# EAGLE schematic FINAL schematic (EAGLE 6.5.0)
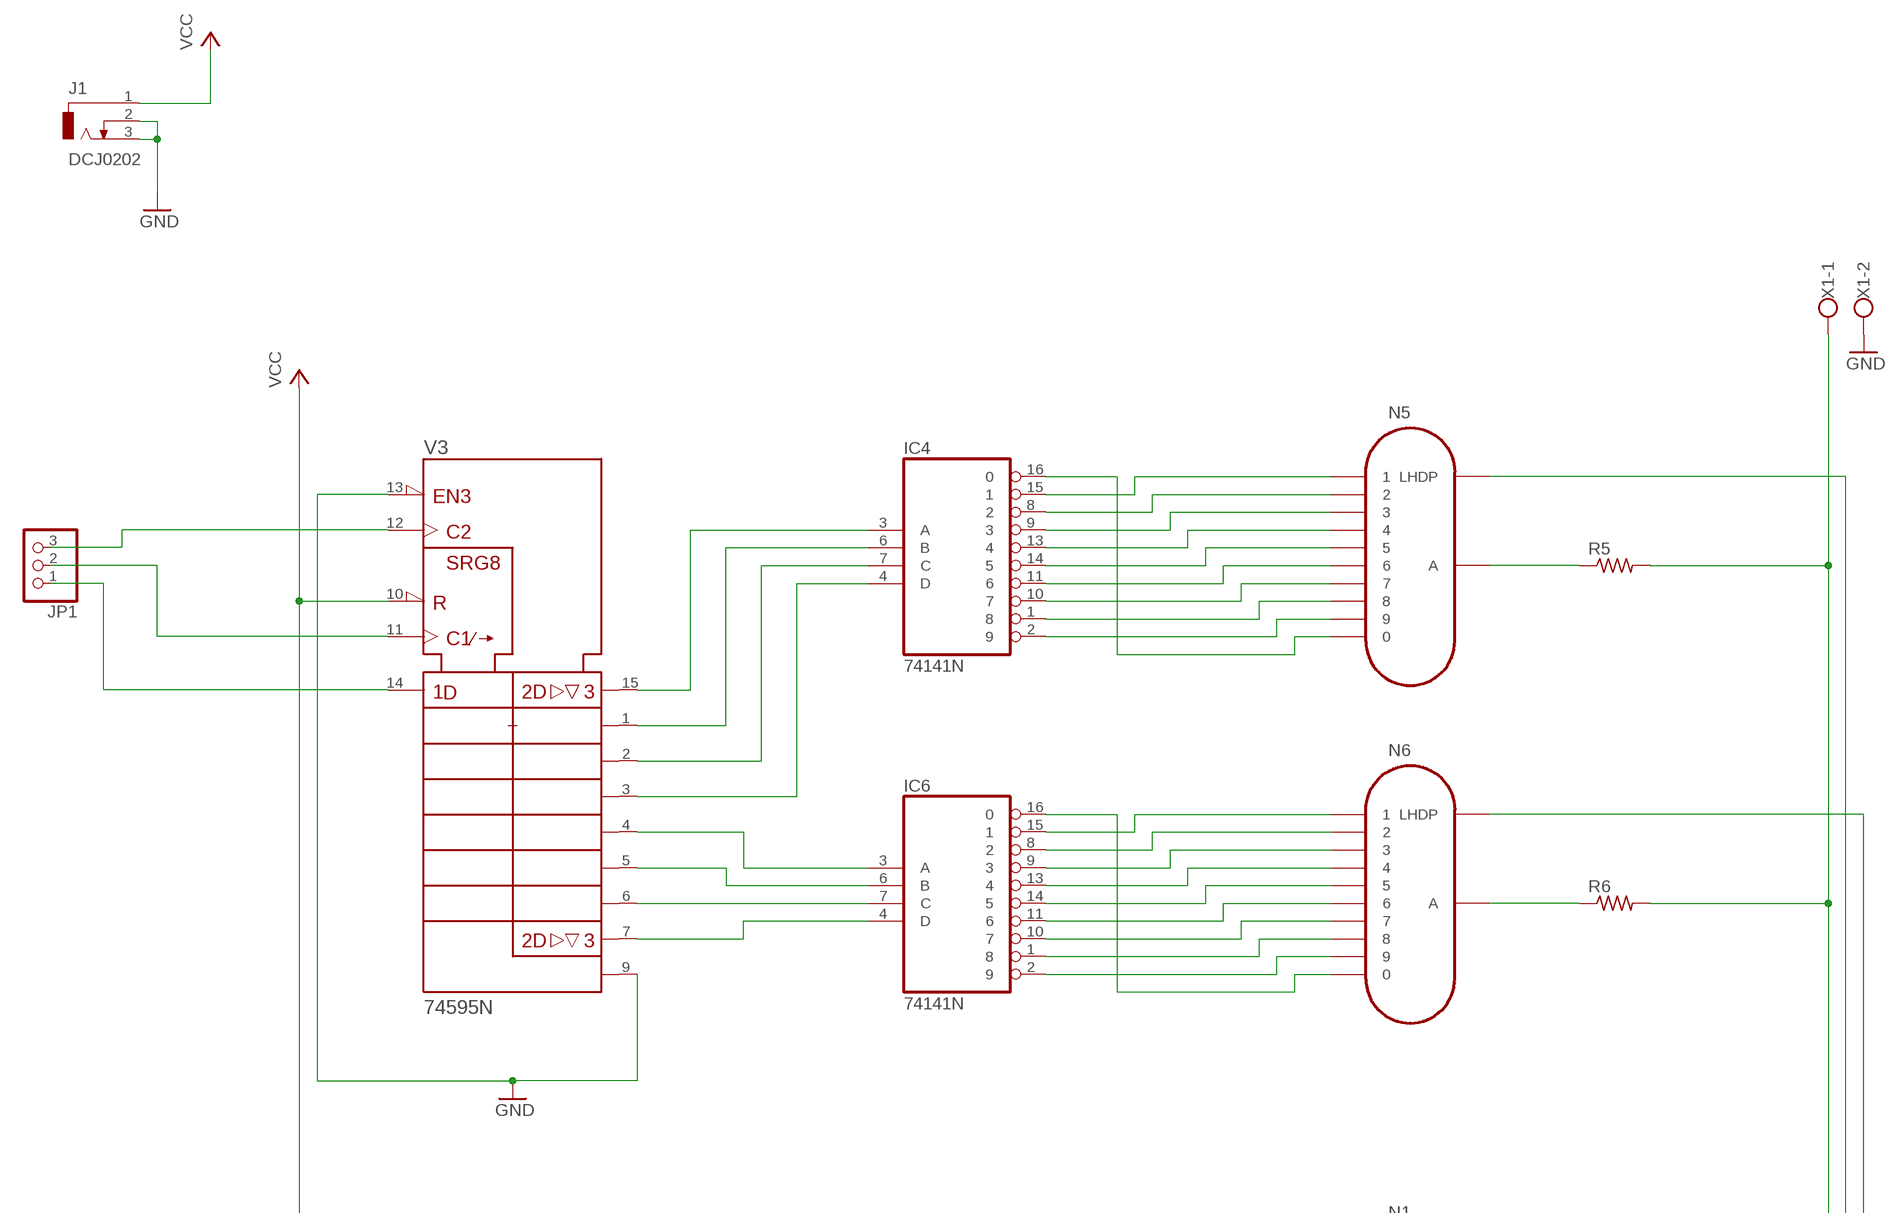
[diagram p0: schematic, sheet 1, part 1 of 2]
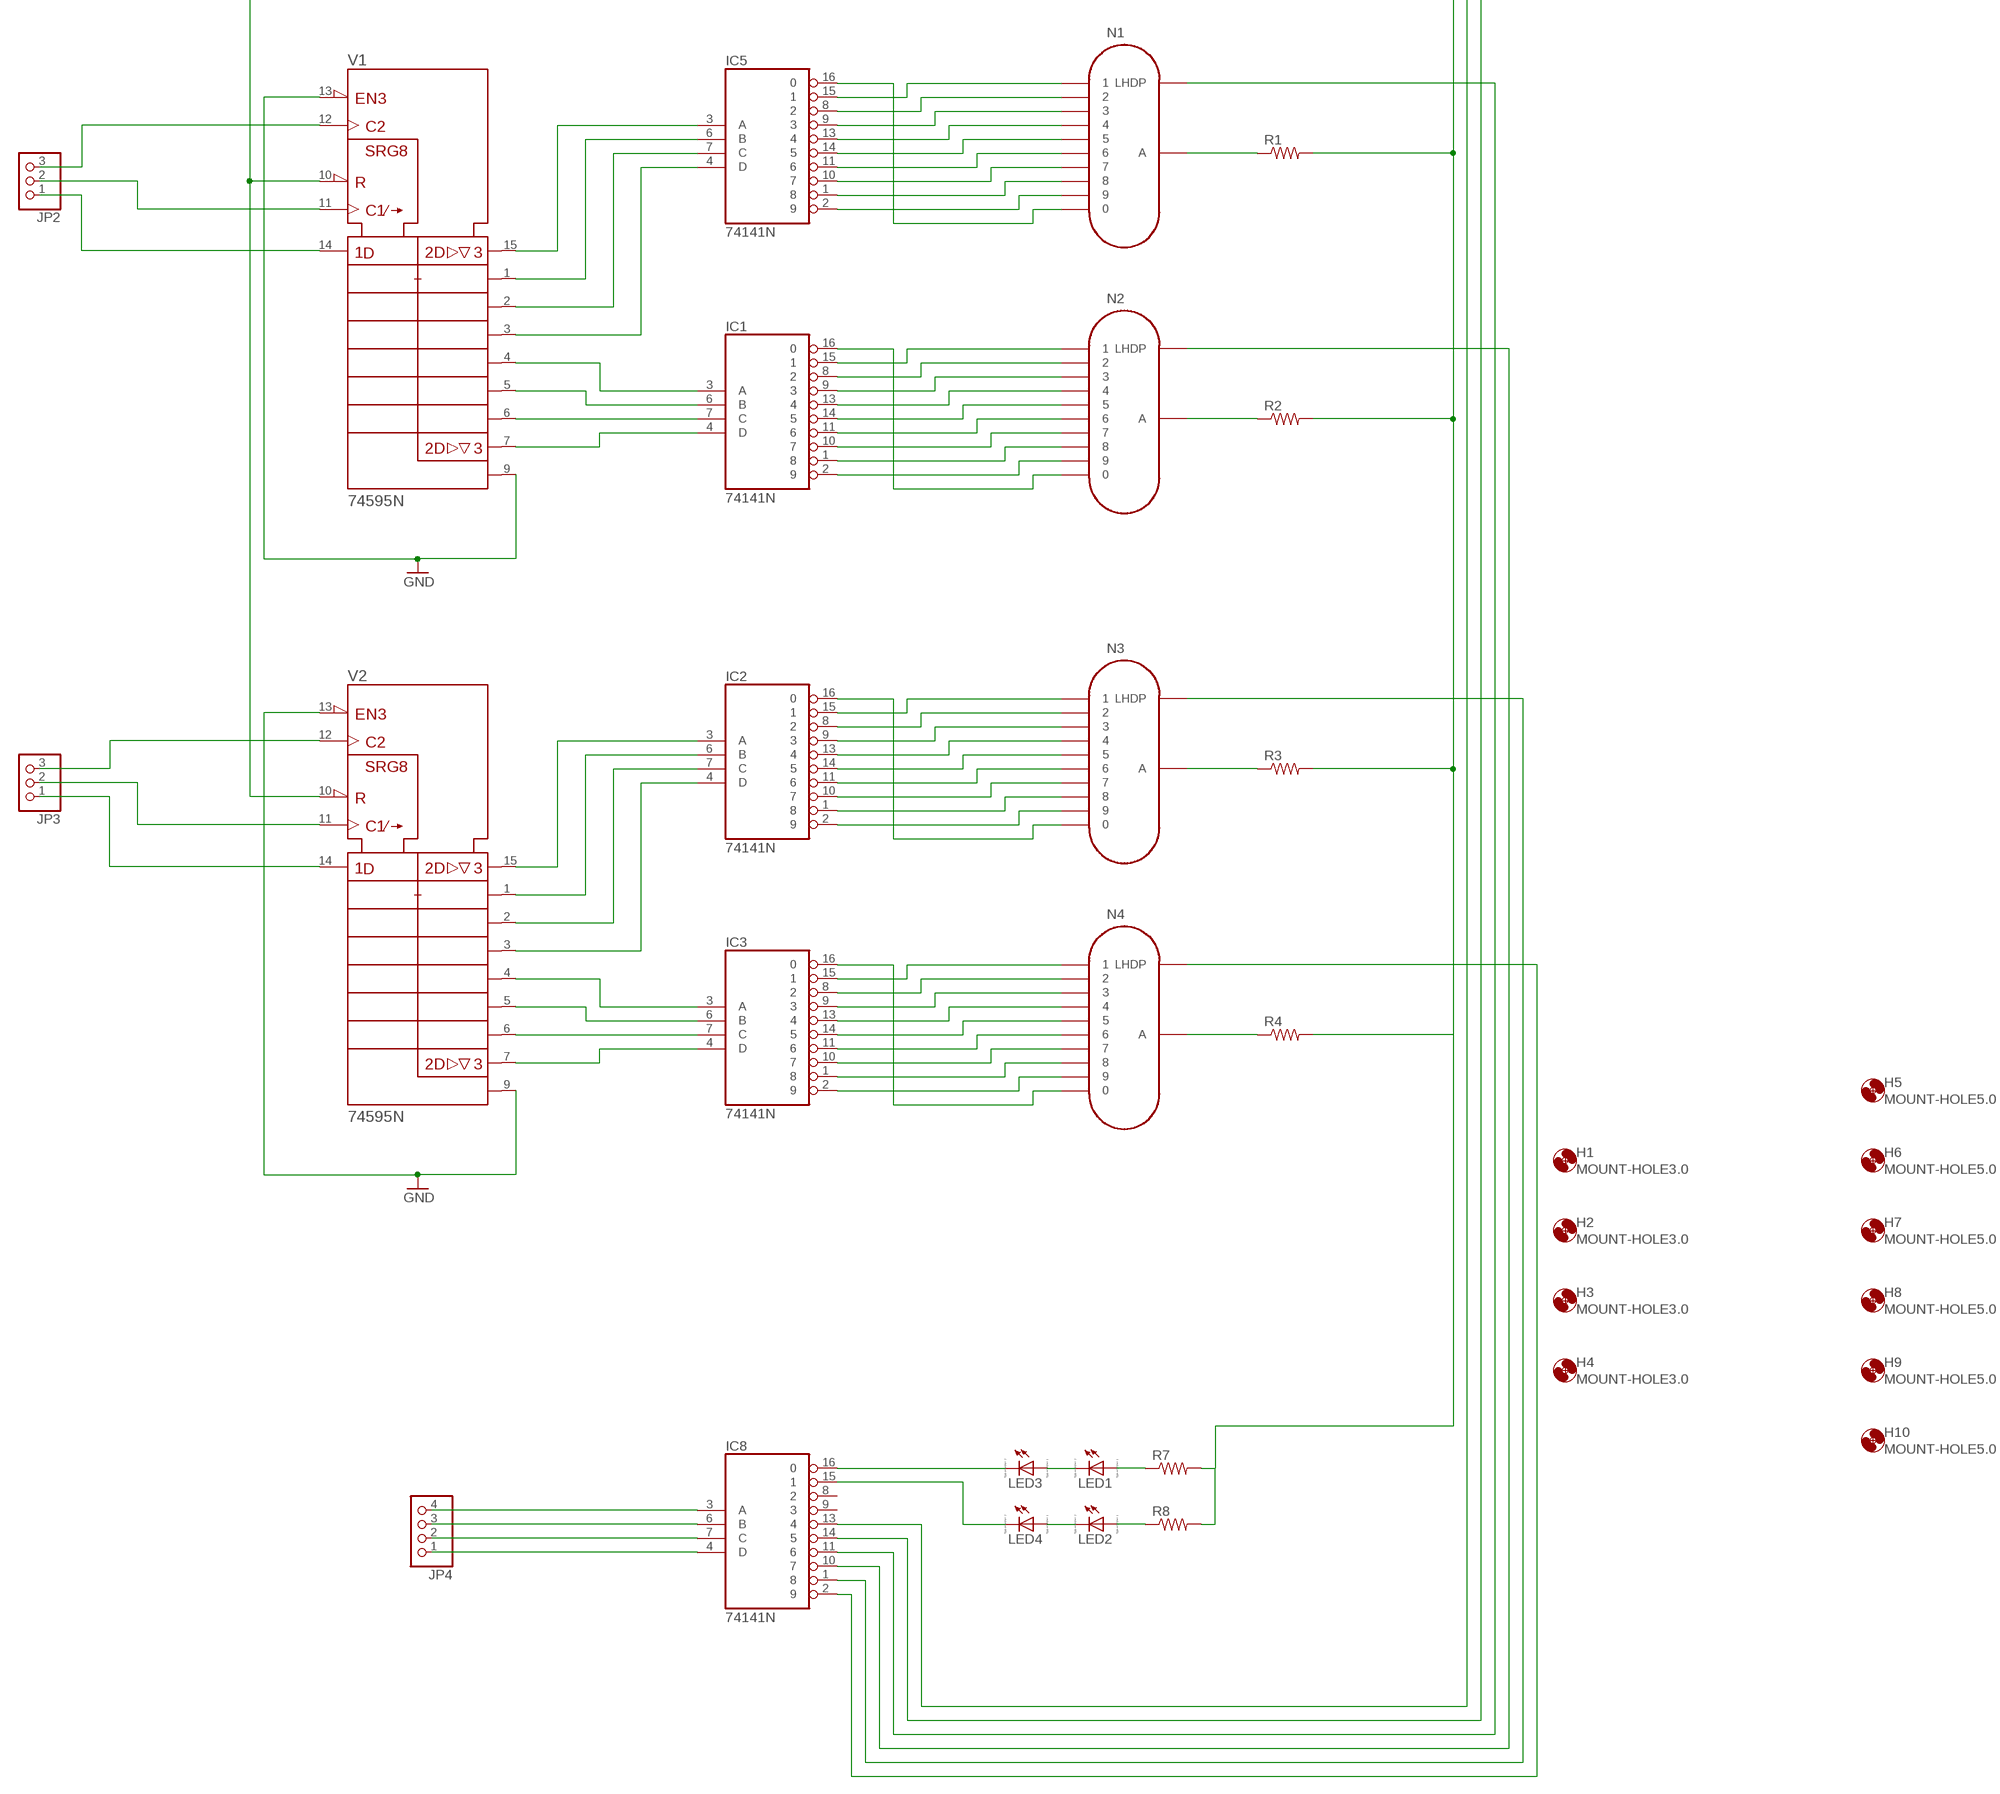
[diagram p1: schematic, sheet 1, part 2 of 2]

## Parts
H1  MOUNT-HOLE3.0  [3,0]
H2  MOUNT-HOLE3.0  [3,0]
H3  MOUNT-HOLE3.0  [3,0]
H4  MOUNT-HOLE3.0  [3,0]
H5  MOUNT-HOLE5.0  [5,0]
H6  MOUNT-HOLE5.0  [5,0]
H7  MOUNT-HOLE5.0  [5,0]
H8  MOUNT-HOLE5.0  [5,0]
H9  MOUNT-HOLE5.0  [5,0]
H10  MOUNT-HOLE5.0  [5,0]
IC1  74141N  [DIL16]
IC2  74141N  [DIL16]
IC3  74141N  [DIL16]
IC4  74141N  [DIL16]
IC5  74141N  [DIL16]
IC6  74141N  [DIL16]
IC8  74141N  [DIL16]
J1  DCJ0202  [DCJ0202]
JP1  PINHD-1X3  [1X03]
JP2  PINHD-1X3  [1X03]
JP3  PINHD-1X3  [1X03]
JP4  PINHD-1X4  [1X04]
LED1  LED_ELD260  [LED_LD260]
LED2  LED_ELD260  [LED_LD260]
LED3  LED_ELD260  [LED_LD260]
LED4  LED_ELD260  [LED_LD260]
N1  IN-12B  [IN-12]
N2  IN-12B  [IN-12]
N3  IN-12B  [IN-12]
N4  IN-12B  [IN-12]
N5  IN-12B  [IN-12]
N6  IN-12B  [IN-12]
R1  R-US_0207/10  [0207/10]
R2  R-US_0207/10  [0207/10]
R3  R-US_0207/10  [0207/10]
R4  R-US_0207/10  [0207/10]
R5  R-US_0207/10  [0207/10]
R6  R-US_0207/10  [0207/10]
R7  R-US_0207/10  [0207/10]
R8  R-US_0207/10  [0207/10]
V1  74595N  [DIL16]
V2  74595N  [DIL16]
V3  74595N  [DIL16]
X1  W237-102  [W237-102]

## Nets
GND: J1.2 J1.3 V1.9(QH*) V1.13(!G) V2.9(QH*) V2.13(!G) V3.9(QH*) V3.13(!G) X1.2
N$1: IC5.16 N1.0
N$2: IC5.15 N1.1
N$3: IC5.8 N1.2
N$4: IC5.9 N1.3
N$5: IC5.13 N1.4
N$6: IC5.14 N1.5
N$7: IC5.11 N1.6
N$8: IC5.10 N1.7
N$9: IC5.1 N1.8
N$10: IC5.2 N1.9
N$11: N1.A R1.1
N$12: IC1.16 N2.0
N$13: IC1.15 N2.1
N$14: IC1.8 N2.2
N$15: IC1.9 N2.3
N$16: IC1.13 N2.4
N$17: IC1.14 N2.5
N$18: IC1.11 N2.6
N$19: IC1.10 N2.7
N$20: IC1.1 N2.8
N$21: IC1.2 N2.9
N$22: N2.A R2.1
N$23: IC5.3(A) V1.15(QA)
N$24: IC5.6(B) V1.1(QB)
N$25: IC5.7(C) V1.2(QC)
N$26: IC5.4(D) V1.3(QD)
N$27: IC1.3(A) V1.4(QE)
N$28: IC1.6(B) V1.5(QF)
N$29: IC1.7(C) V1.6(QG)
N$30: IC1.4(D) V1.7(QH)
N$31: JP2.2 V1.11(SRCK)
N$32: JP2.1 V1.14(SER)
N$33: JP2.3 V1.12(RCK)
N$34: JP1.3 V3.12(RCK)
N$35: JP1.1 V3.14(SER)
N$36: IC2.16 N3.0
N$37: IC2.15 N3.1
N$38: IC2.8 N3.2
N$39: IC2.9 N3.3
N$40: IC2.13 N3.4
N$41: IC2.14 N3.5
N$42: IC2.11 N3.6
N$43: IC2.10 N3.7
N$44: IC2.1 N3.8
N$45: IC2.2 N3.9
N$46: N3.A R3.1
N$47: IC3.16 N4.0
N$48: IC3.15 N4.1
N$49: IC3.8 N4.2
N$50: IC3.9 N4.3
N$51: IC3.13 N4.4
N$52: IC3.14 N4.5
N$53: IC3.11 N4.6
N$54: IC3.10 N4.7
N$55: IC3.1 N4.8
N$56: IC3.2 N4.9
N$57: N4.A R4.1
N$58: IC2.3(A) V2.15(QA)
N$59: IC2.6(B) V2.1(QB)
N$60: IC2.7(C) V2.2(QC)
N$61: IC2.4(D) V2.3(QD)
N$62: IC3.3(A) V2.4(QE)
N$63: IC3.6(B) V2.5(QF)
N$64: IC3.7(C) V2.6(QG)
N$65: IC3.4(D) V2.7(QH)
N$66: JP1.2 V3.11(SRCK)
N$67: JP3.1 V2.14(SER)
N$68: JP3.2 V2.11(SRCK)
N$69: IC4.16 N5.0
N$70: IC4.15 N5.1
N$71: IC4.8 N5.2
N$72: IC4.9 N5.3
N$73: IC4.13 N5.4
N$74: IC4.14 N5.5
N$75: IC4.11 N5.6
N$76: IC4.10 N5.7
N$77: IC4.1 N5.8
N$78: IC4.2 N5.9
N$79: N5.A R5.1
N$80: IC6.16 N6.0
N$81: IC6.15 N6.1
N$82: IC6.8 N6.2
N$83: IC6.9 N6.3
N$84: IC6.13 N6.4
N$85: IC6.14 N6.5
N$86: IC6.11 N6.6
N$87: IC6.10 N6.7
N$88: IC6.1 N6.8
N$89: IC6.2 N6.9
N$90: N6.A R6.1
N$91: IC4.3(A) V3.15(QA)
N$92: IC4.6(B) V3.1(QB)
N$93: IC4.7(C) V3.2(QC)
N$94: IC4.4(D) V3.3(QD)
N$95: IC6.3(A) V3.4(QE)
N$96: IC6.6(B) V3.5(QF)
N$97: IC6.7(C) V3.6(QG)
N$98: IC6.4(D) V3.7(QH)
N$99: JP3.3 V2.12(RCK)
N$100: R1.2 R2.2 R3.2 R4.2 R5.2 R6.2 R7.2 R8.2 X1.1
N$101: IC8.3(A) JP4.4
N$102: IC8.6(B) JP4.3
N$103: IC8.7(C) JP4.2
N$104: IC8.4(D) JP4.1
N$105: IC8.16 LED3.K(C)
N$106: LED1.K(C) LED3.A
N$107: IC8.15 LED4.K(C)
N$108: LED2.K(C) LED4.A
N$109: IC8.13 N5.LHDP
N$110: LED1.A R7.1
N$111: LED2.A R8.1
N$114: IC8.14 N6.LHDP
N$115: IC8.11 N1.LHDP
N$116: IC8.10 N2.LHDP
N$117: IC8.1 N3.LHDP
N$118: IC8.2 N4.LHDP
VCC: J1.1 V1.10(!SRCLR) V2.10(!SRCLR) V3.10(!SRCLR)
Unconnected: IC8.8 IC8.9

## Power pins joined to a net without a drawn wire
+UB: V1.16(+UB) V2.16(+UB) V3.16(+UB)
-UB: V1.8(-UB) V2.8(-UB) V3.8(-UB)
GND: IC1.12(GND) IC2.12(GND) IC3.12(GND) IC4.12(GND) IC5.12(GND) IC6.12(GND) IC8.12(GND)
VCC: IC1.5(VCC) IC2.5(VCC) IC3.5(VCC) IC4.5(VCC) IC5.5(VCC) IC6.5(VCC) IC8.5(VCC)

## Library data of the parts
H1-H10 = holes:MOUNT-HOLE: MOUNTING HOLE with drill center marker
IC1-IC6 IC8 = 74xx-us:74*141: BCD to decimal DECODER/DRIVER
J1 = con-jack:DCJ0202: DC POWER JACK Source: DCJ0202.pdf; OC_FARNELL: unknown; OC_NEWARK: unknown
JP1-JP3 = pinhead:PINHD-1X3: PIN HEADER
JP4 = pinhead:PINHD-1X4: PIN HEADER
LED1-LED4 = eagle-ltspice:LED_E: LED Source: http://www.osram.convergy.de Source: www.luxeon.com Source: www.kingbright.com; SPICEMODEL: NONE; SPICEPREFIX: D; SPICETYPE: diode
N1-N6 = russian-nixies:IN-12B: IN-12B: medium numeric topview nixie tube
R1-R8 = resistor:R-US_: RESISTOR, American symbol
V1-V3 = 74ttl-din:74*595: 8-bit SHIFT REGISTER, output latch
X1 = con-wago-500:W237-102: WAGO SCREW CLAMP; MPN: 237-102; OC_FARNELL: unknown; OC_NEWARK: 70K9898